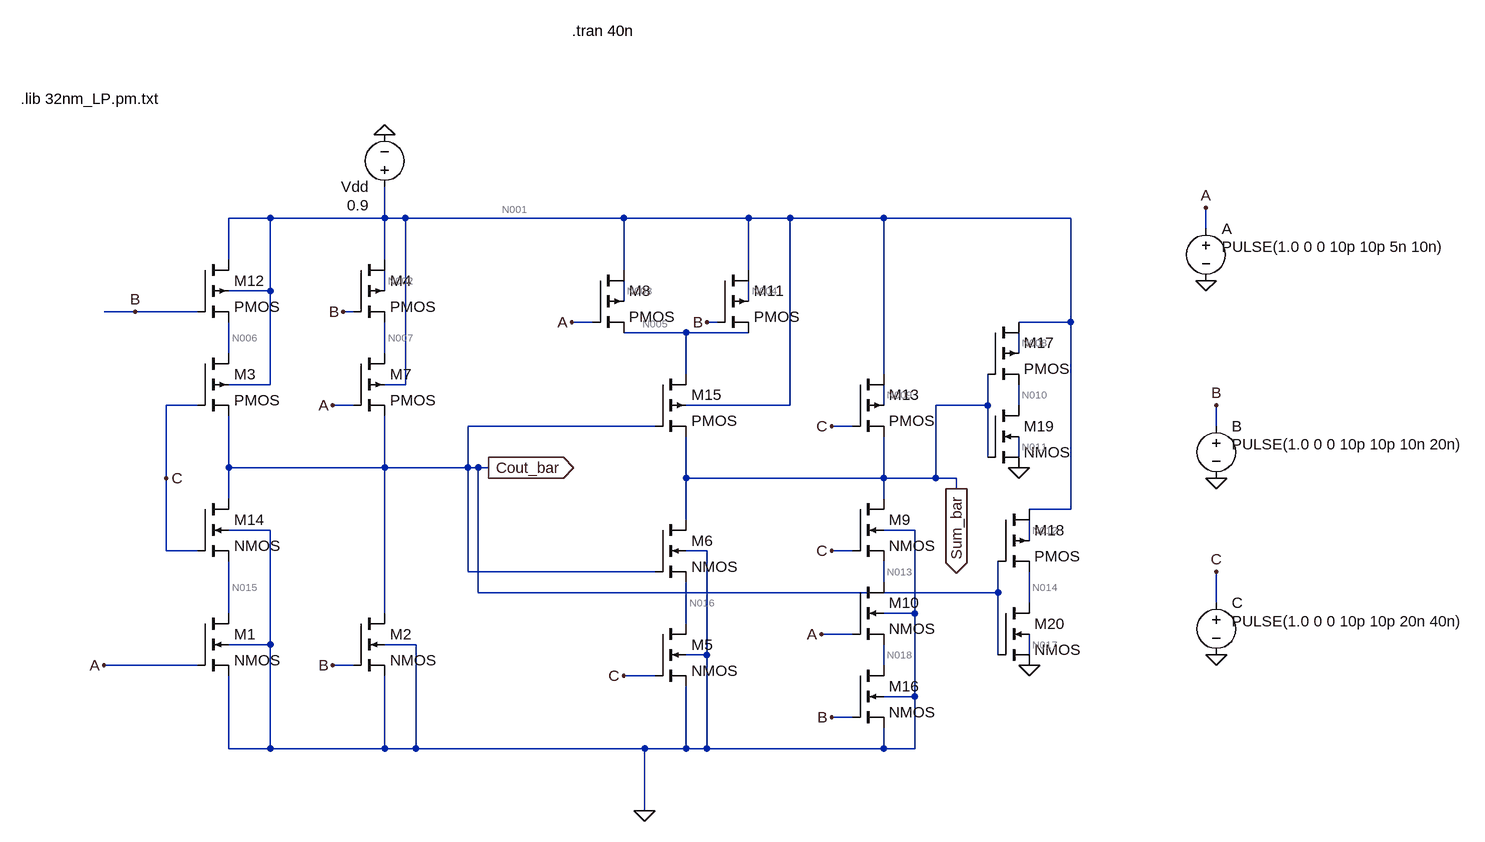
[diagram p0: schematic AMA1_32nm.asc]
AMA1_32nm.asc, the LTspice schematic file:
Version 4
SHEET 1 1044 692
WIRE -816 -240 -880 -240
WIRE -640 -240 -640 -288
WIRE -640 -240 -816 -240
WIRE -608 -240 -640 -240
WIRE -272 -240 -608 -240
WIRE -80 -240 -272 -240
WIRE -16 -240 -80 -240
WIRE 128 -240 -16 -240
WIRE 416 -240 128 -240
WIRE 624 -224 624 -256
WIRE -880 -176 -880 -240
WIRE -640 -176 -640 -240
WIRE -272 -160 -272 -240
WIRE -80 -160 -80 -240
WIRE -816 -128 -816 -240
WIRE -816 -128 -880 -128
WIRE -640 -128 -640 -160
WIRE -272 -112 -272 -144
WIRE -80 -112 -80 -144
WIRE -1024 -96 -1072 -96
WIRE -928 -96 -1024 -96
WIRE -688 -96 -704 -96
WIRE -320 -80 -352 -80
WIRE -128 -80 -144 -80
WIRE 416 -80 416 -240
WIRE 416 -80 336 -80
WIRE -176 -64 -272 -64
WIRE -80 -64 -176 -64
WIRE -880 -32 -880 -80
WIRE -640 -32 -640 -80
WIRE 336 -32 336 -64
WIRE -176 0 -176 -64
WIRE 128 0 128 -240
WIRE -816 16 -816 -128
WIRE -816 16 -880 16
WIRE -608 16 -608 -240
WIRE -608 16 -640 16
WIRE -928 48 -976 48
WIRE -688 48 -720 48
WIRE -16 48 -16 -240
WIRE -16 48 -176 48
WIRE 128 48 128 16
WIRE 288 48 288 0
WIRE 288 48 208 48
WIRE 336 48 336 16
WIRE -224 80 -512 80
WIRE 80 80 48 80
WIRE 640 80 640 48
WIRE 288 128 288 48
WIRE 336 128 336 96
WIRE -880 144 -880 64
WIRE -640 144 -640 64
WIRE -640 144 -880 144
WIRE -512 144 -512 80
WIRE -512 144 -640 144
WIRE -496 144 -512 144
WIRE -480 144 -496 144
WIRE -976 160 -976 48
WIRE -176 160 -176 96
WIRE 128 160 128 96
WIRE 128 160 -176 160
WIRE 208 160 208 48
WIRE 208 160 128 160
WIRE 240 160 208 160
WIRE 240 176 240 160
WIRE -880 192 -880 144
WIRE 128 192 128 160
WIRE 416 208 416 -80
WIRE 416 208 352 208
WIRE -176 224 -176 160
WIRE -816 240 -880 240
WIRE 176 240 128 240
WIRE 352 256 352 224
WIRE -976 272 -976 160
WIRE -928 272 -976 272
WIRE -144 272 -176 272
WIRE 80 272 48 272
WIRE -512 304 -512 144
WIRE -224 304 -512 304
WIRE 128 320 128 288
WIRE -496 336 -496 144
WIRE 304 336 304 288
WIRE 304 336 -496 336
WIRE 352 352 352 304
WIRE 640 352 640 304
WIRE -880 368 -880 288
WIRE -640 368 -640 144
WIRE 176 368 176 240
WIRE 176 368 128 368
WIRE -176 384 -176 320
WIRE 80 400 32 400
WIRE -816 416 -816 240
WIRE -816 416 -880 416
WIRE -592 416 -640 416
WIRE -144 432 -144 272
WIRE -144 432 -176 432
WIRE 304 432 304 336
WIRE 352 432 352 400
WIRE -928 448 -1072 448
WIRE -688 448 -720 448
WIRE 128 448 128 416
WIRE -224 464 -272 464
WIRE 176 496 176 368
WIRE 176 496 128 496
WIRE 80 528 48 528
WIRE -880 576 -880 464
WIRE -816 576 -816 416
WIRE -816 576 -880 576
WIRE -640 576 -640 464
WIRE -640 576 -816 576
WIRE -592 576 -592 416
WIRE -592 576 -640 576
WIRE -240 576 -592 576
WIRE -176 576 -176 480
WIRE -176 576 -240 576
WIRE -144 576 -144 432
WIRE -144 576 -176 576
WIRE 128 576 128 544
WIRE 128 576 -144 576
WIRE 176 576 176 496
WIRE 176 576 128 576
WIRE -240 672 -240 576
FLAG -240 672 0
FLAG -480 144 Cout_bar
IOPIN -480 144 Out
FLAG 240 176 Sum_bar
IOPIN 240 176 Out
FLAG 624 -144 0
FLAG 640 160 0
FLAG 640 432 0
FLAG 624 -256 A
FLAG 640 48 B
FLAG 640 304 C
FLAG -640 -368 0
FLAG -1024 -96 B
FLAG -704 -96 B
FLAG -720 448 B
FLAG -144 -80 B
FLAG 48 528 B
FLAG -1072 448 A
FLAG -720 48 A
FLAG 32 400 A
FLAG -352 -80 A
FLAG -976 160 C
FLAG 48 80 C
FLAG 48 272 C
FLAG -272 464 C
FLAG 336 144 0
FLAG 352 448 0
SYMBOL pmos4 -928 -176 R0
SYMATTR InstName M12
SYMATTR Value2 l=32n w=128n
SYMBOL voltage 624 -240 R0
WINDOW 3 24 44 Left 2
WINDOW 123 0 0 Left 0
WINDOW 39 0 0 Left 0
SYMATTR Value PULSE(1.0 0 0 10p 10p 5n 10n)
SYMATTR InstName A
SYMBOL voltage 640 64 R0
WINDOW 3 24 44 Left 2
WINDOW 123 0 0 Left 0
WINDOW 39 0 0 Left 0
SYMATTR Value PULSE(1.0 0 0 10p 10p 10n 20n)
SYMATTR InstName B
SYMBOL voltage 640 336 R0
WINDOW 3 24 44 Left 2
WINDOW 123 0 0 Left 0
WINDOW 39 0 0 Left 0
SYMATTR Value PULSE(1.0 0 0 10p 10p 20n 40n)
SYMATTR InstName C
SYMBOL voltage -640 -272 R180
WINDOW 3 24 -12 Left 2
WINDOW 123 0 0 Left 0
WINDOW 39 0 0 Left 0
SYMATTR Value 0.9
SYMATTR InstName Vdd
SYMBOL nmos4 -928 192 R0
SYMATTR InstName M14
SYMATTR Value2 l=32n w=64n
SYMBOL pmos4 -928 -32 R0
SYMATTR InstName M3
SYMATTR Value2 l=32n w=128n
SYMBOL pmos4 -688 -176 R0
SYMATTR InstName M4
SYMATTR Value2 l=32n w=128n
SYMBOL pmos4 -688 -32 R0
SYMATTR InstName M7
SYMATTR Value2 l=32n w=128n
SYMBOL pmos4 -320 -160 R0
SYMATTR InstName M8
SYMATTR Value2 l=32n w=128n
SYMBOL pmos4 -128 -160 R0
SYMATTR InstName M11
SYMATTR Value2 l=32n w=128n
SYMBOL pmos4 80 0 R0
SYMATTR InstName M13
SYMATTR Value2 l=32n w=128n
SYMBOL pmos4 -224 0 R0
SYMATTR InstName M15
SYMATTR Value2 l=32n w=128n
SYMBOL nmos4 -928 368 R0
SYMATTR InstName M1
SYMATTR Value2 l=32n w=64n
SYMBOL nmos4 -688 368 R0
SYMATTR InstName M2
SYMATTR Value2 l=32n w=64n
SYMBOL nmos4 -224 384 R0
SYMATTR InstName M5
SYMATTR Value2 l=32n w=64n
SYMBOL nmos4 -224 224 R0
SYMATTR InstName M6
SYMATTR Value2 l=32n w=64n
SYMBOL nmos4 80 192 R0
SYMATTR InstName M9
SYMATTR Value2 l=32n w=64n
SYMBOL nmos4 80 320 R0
SYMATTR InstName M10
SYMATTR Value2 l=32n w=64n
SYMBOL nmos4 80 448 R0
SYMATTR InstName M16
SYMATTR Value2 l=32n w=64n
SYMBOL pmos4 288 -80 R0
SYMATTR InstName M17
SYMATTR Value2 l=32n w=128n
SYMBOL pmos4 304 208 R0
SYMATTR InstName M18
SYMATTR Value2 l=32n w=128n
SYMBOL nmos4 288 48 R0
SYMATTR InstName M19
SYMATTR Value2 l=32n w=64n
SYMBOL nmos4 304 352 R0
SYMATTR InstName M20
SYMATTR Value2 l=32n w=64n
TEXT -1200 -424 Left 2 !.lib 32nm_LP.pm.txt
TEXT -352 -528 Left 2 !.tran 40n

The netlist it stands for:
* AMA1_32nm.asc
M12 N001 B N006 N001 PMOS l=32n w=128n
V§A A 0 PULSE(1.0 0 0 10p 10p 5n 10n)
V§B B 0 PULSE(1.0 0 0 10p 10p 10n 20n)
V§C C 0 PULSE(1.0 0 0 10p 10p 20n 40n)
Vdd N001 0 0.9
M14 Cout_bar C N015 0 NMOS l=32n w=64n
M3 N006 C Cout_bar N001 PMOS l=32n w=128n
M4 N001 B N007 N002 PMOS l=32n w=128n
M7 N007 A Cout_bar N001 PMOS l=32n w=128n
M8 N001 A N005 N003 PMOS l=32n w=128n
M11 N001 B N005 N004 PMOS l=32n w=128n
M13 N001 C Sum_bar N009 PMOS l=32n w=128n
M15 N005 Cout_bar Sum_bar N001 PMOS l=32n w=128n
M1 N015 A 0 0 NMOS l=32n w=64n
M2 Cout_bar B 0 0 NMOS l=32n w=64n
M5 N016 C 0 0 NMOS l=32n w=64n
M6 Sum_bar Cout_bar N016 0 NMOS l=32n w=64n
M9 Sum_bar C N013 0 NMOS l=32n w=64n
M10 N013 A N018 0 NMOS l=32n w=64n
M16 N018 B 0 0 NMOS l=32n w=64n
M17 N001 Sum_bar N010 N008 PMOS l=32n w=128n
M18 N001 Cout_bar N014 N012 PMOS l=32n w=128n
M19 N010 Sum_bar 0 N011 NMOS l=32n w=64n
M20 N014 Cout_bar 0 N017 NMOS l=32n w=64n
.model NMOS NMOS
.model PMOS PMOS
.lib standard.mos
.lib 32nm_LP.pm.txt
.tran 40n
.backanno
.end

* Results of the author's LTspice run, read from the files saved beside the schematic
* Operating Point, zero values left out:
*   V(n001) = 900 mV
*   V(b) = 1 V
*   V(n006) = 781.7 mV
*   V(a) = 1 V
*   V(c) = 1 V
*   V(cout_bar) = 270 nV
*   V(n015) = 238 nV
*   V(n007) = 794.4 mV
*   V(n002) = 790.6 mV
*   V(n005) = 205 mV
*   V(n003) = 775.5 mV
*   V(n004) = 775.5 mV
*   V(sum_bar) = 6.9 µV
*   V(n009) = 771.7 mV
*   V(n016) = 103 nV
*   V(n013) = 4.806 µV
*   V(n018) = 2.506 µV
*   V(n010) = 899.9 mV
*   V(n008) = 765.7 mV
*   V(n014) = 899.9 mV
*   V(n012) = 765.7 mV
*   V(n011) = 256.2 mV
*   V(n017) = 256.2 mV
*   Id(M20) = 15.24 nA
*   Ig(M20) = -21.64 pA
*   Is(M20) = -15.21 nA
*   Id(M19) = 15.24 nA
*   Ig(M19) = -21.64 pA
*   Is(M19) = -15.22 nA
*   Id(M16) = 690.1 pA
*   Ig(M16) = 66.86 pA
*   Ib(M16) = -7.698 pA
*   Is(M16) = -749.3 pA
*   Id(M10) = 631 pA
*   Ig(M10) = 66.86 pA
*   Ib(M10) = -7.698 pA
*   Is(M10) = -690.1 pA
*   Id(M9) = 571.8 pA
*   Ig(M9) = 66.86 pA
*   Ib(M9) = -7.697 pA
*   Is(M9) = -631 pA
*   Ig(M5) = 66.86 pA
*   Ib(M5) = -7.698 pA
*   Is(M5) = -59.17 pA
*   Id(M2) = 47.96 pA
*   Ig(M2) = 66.86 pA
*   Ib(M2) = -7.698 pA
*   Is(M2) = -107.1 pA
*   Id(M1) = 38.77 pA
*   Ig(M1) = 66.86 pA
*   Ib(M1) = -7.698 pA
*   Is(M1) = -97.94 pA
*   Id(M14) = -20.39 pA
*   Ig(M14) = 66.86 pA
*   Ib(M14) = -7.698 pA
*   Is(M14) = -38.77 pA
*   Id(M18) = 15.24 nA
*   Ig(M18) = -1.297 pA
*   Is(M18) = -15.24 nA
*   Id(M17) = 15.24 nA
*   Ig(M17) = -1.297 pA
*   Is(M17) = -15.24 nA
*   Id(M15) = 171.2 pA
*   Ib(M15) = 1.608 pA
*   Is(M15) = -172.8 pA
*   Id(M13) = 376.8 pA
*   Is(M13) = -376.1 pA
*   Id(M11) = 86.37 pA
*   Is(M11) = -85.6 pA
*   Id(M8) = 86.37 pA
*   Is(M8) = -85.6 pA
*   Id(M7) = 1.664 pA
*   Ib(M7) = 1.015 pA
*   Is(M7) = -2.684 pA
*   Id(M4) = 2.454 pA
*   Is(M4) = -1.664 pA
*   Ib(M3) = 1.028 pA
*   Is(M3) = -1.945 pA
*   I(Vdd) = -31.04 nA
*   I(C) = -200.6 pA
*   I(B) = -133.7 pA
*   I(A) = -133.7 pA
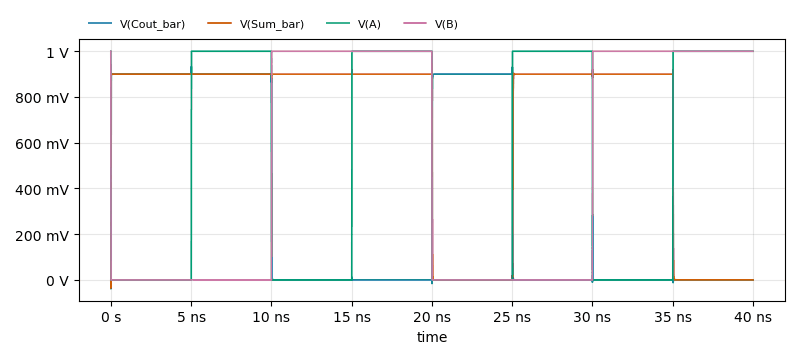
[diagram p1: Transient Analysis of AMA1_32nm.asc, plotted from the saved traces]
* Transient Analysis, 1 run:
*   V(Cout_bar): min -38.95 mV, max 933.6 mV, average 338.1 mV, rms 551.3 mV, last 1.073 µV
*   V(Sum_bar): min -35.88 mV, max 947.2 mV, average 675.3 mV, rms 779.3 mV, last 19.5 µV
*   V(A): min 0 V, max 1 V, average 499 mV, rms 706.2 mV, last 1 V
*   V(B): min 0 V, max 1 V, average 499.5 mV, rms 706.6 mV, last 1 V